# Altium project LimeSDR-Micro_mPCIe_1v4.PrjPcb (part 9 of 10)
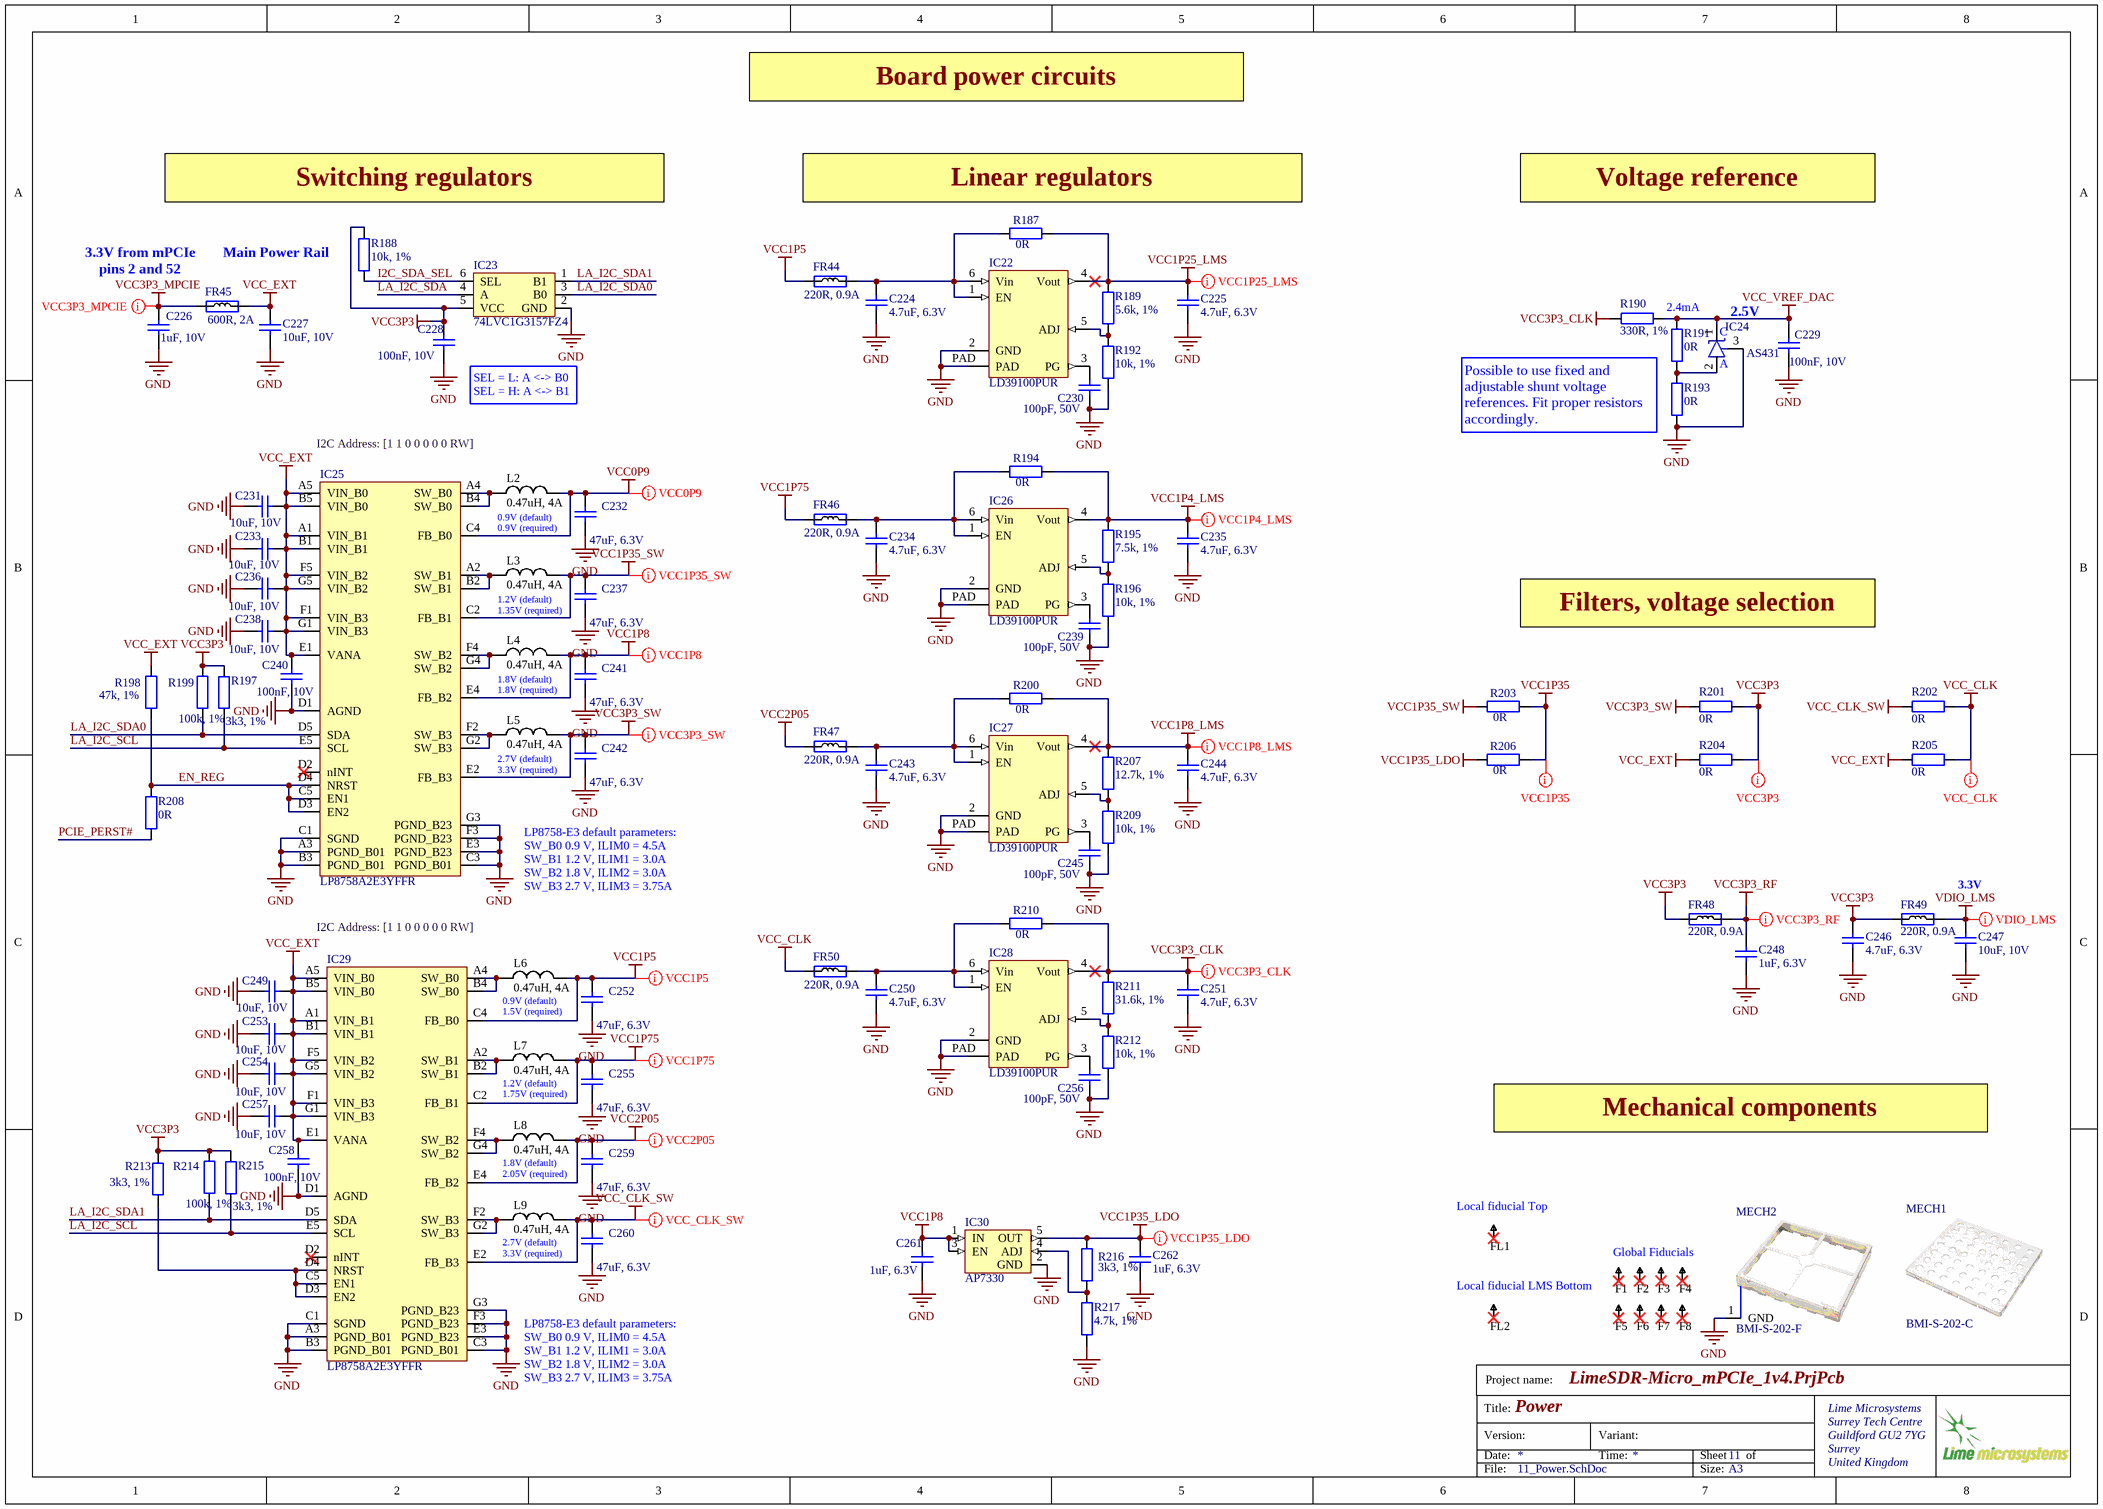
[diagram p14: 11_Power.SchDoc]

## Sheet 11_Power.SchDoc: Power (continued)
### Library data of the parts
C224 C225 C234 C235 C243 C244 C246 C250 C251 = Cap_0402: Manufacturer: Murata Electronics North America; Manufacturer Part Number 1: GRM155R60J475ME87D; Part Description: 4.7µF ±20% 6.3V X5R Ceramic Capacitor -55°C ~ 85°C Surface Mount, MLCC 0402 (1005 Metric) 0.039" L x 0.020" W (1.00mm x 0.50mm); Tolerance: ±20%; Capacitance: 4.7µF; Temperature Coefficient: X5R; Lead Style: -; Ratings: -; Height - Seated (Max): -; Thickness (Max): 0.022" (0.55mm); Voltage - Rated: 6.3V; Packaging: Cut Tape (CT); Lead Spacing: -; Category: Capacitors; Supplier Part Number 1: 490-5408-1-ND; Applications: General Purpose; Operating Temperature: -55°C ~ 85°C; Mounting Type: Surface Mount, MLCC; Features: Derating Recommended; RoHS: RoHS Compliant; Supplier 1: Digi-Key; Package / Case: 0402 (1005 Metric); Size / Dimension: 0.039" L x 0.020" W (1.00mm x 0.50mm); Value: 4.7uF, 6.3V
C226 = Cap_0402: Manufacturer Part Number 1: C1005X5R1E105K050BC; Manufacturer: TDK; Part Description: 1µF ±10% 10V X5R Ceramic Capacitor -55°C ~ 85°C Surface Mount, MLCC 0402 (1005 Metric) 0.039" L x 0.020" W (1.00mm x 0.50mm); Voltage Rating: 10; Capacitance Tolerance: ± 10%; Product Range: TDK - C Series; Ceramic Capacitor Case: 0402 [1005 Metric]; Capacitance: 1; Dielectric Characteristic: X6; Value: 1uF, 10V; Supplier 1: Digi-Key; Supplier Part Number 1: 445-9066-1-ND; MSL: -; RoHS: YES
C227 C233 C236 C238 C247 C249 C253 C254 C257 = Cap_0603: Part Description: 10 µF ±20% 10V Ceramic Capacitor X5R 0603 (1608 Metric); Manufacturer: Murata; Manufacturer Part Number 1: GRM188R61A106ME69D; Dielectric: X5R; Material: Ceramic; Tolerance: 20%; Value: 10uF, 10V; ComponentLink1Description: http://search.murata.co.jp/Ceramy/image/img/A01X/G101/ENG/GRM188R61C106MAAL-01.pdf?src-supplier=Digi-Key; ComponentLink1URL: http://search.murata.co.jp/Ceramy/image/img/A01X/G101/ENG/GRM188R61C106MAAL-01.pdf?src-supplier=Digi-Key; ComponentLink2Description: https://search.murata.co.jp/Ceramy/image/img/A01X/G101/ENG/GRM188R61C106MAAL-01.pdf?src-supplier=Digi-Key; ComponentLink2URL: https://search.murata.co.jp/Ceramy/image/img/A01X/G101/ENG/GRM188R61C106MAAL-01.pdf?src-supplier=Digi-Key; ComponentLink3Description: http://search.murata.co.jp/Ceramy/image/img/A01X/partnumbering_e_01.pdf?src-supplier=Digi-Key; ComponentLink3URL: http://search.murata.co.jp/Ceramy/image/img/A01X/partnumbering_e_01.pdf?src-supplier=Digi-Key; Capacitance: 10uF; Case/Package: 0603; Case Code (Imperial): 0603; Case Code (Metric): 1608; ComponentLink4Description: http://www.farnell.com/datasheets/1872210.pdf?src-supplier=Farnell; ComponentLink4URL: http://www.farnell.com/datasheets/1872210.pdf?src-supplier=Farnell; ComponentLink5Description: http://www.mouser.com/ds/2/281/c02e-2905.pdf?src-supplier=Mouser; ComponentLink5URL: http://www.mouser.com/ds/2/281/c02e-2905.pdf?src-supplier=Mouser; ComponentLink6Description: http://www.farnell.com/datasheets/1872210.pdf?src-supplier=Newark; ComponentLink6URL: http://www.farnell.com/datasheets/1872210.pdf?src-supplier=Newark; ComponentLink7Description: http://www.farnell.com/datasheets/2048014.pdf?src-supplier=Element14; ComponentLink7URL: http://www.farnell.com/datasheets/2048014.pdf?src-supplier=Element14; ComponentLink8Description: http://www.farnell.com/datasheets/1872210.pdf?src-supplier=Element14; ComponentLink8URL: http://www.farnell.com/datasheets/1872210.pdf?src-supplier=Element14; ComponentLink9Description: http://search.murata.co.jp/Ceramy/image/img/A01X/G101/ENG/GRM188R61A106ME69-01.pdf?src-supplier=Digi-Key; ComponentLink9URL: http://search.murata.co.jp/Ceramy/image/img/A01X/G101/ENG/GRM188R61A106ME69-01.pdf?src-supplier=Digi-Key; Depth: 0.8mm; Height: 0.8mm; Lead Free: Lead Free; Length: 1.6mm; Max Operating Temperature: 85°C; Min Operating Temperature: -55°C; Mount: Surface Mount; Package Quantity: 4000; Packaging: Tape and Reel; Pricing 1: 1=0,16000, 10=0,11200, 50=0,06360, 100=0,05270, 500=0,03696, 1000=0,03060 (USD); RoHS: Yes; RoHS Compliant: Yes; Series: GRM; Stock 1: 820978; Supplier 1: Digi-Key; Supplier Part Number 1: 490-10475-1-ND; Termination: SMD/SMT; Thickness: 0.035inch; Voltage Rating (DC): 10V; Voltage Rating: 10V; Weight: 0.000222oz; Width: 0.8mm
C228 C229 C240 C258 = Cap_0402: Part Description: 0.1 µF ±20% 10V Ceramic Capacitor X5R 0201 (0603 Metric); Manufacturer: Samsung; Manufacturer Part Number 1: CL03A104MP3NNNC; Tolerance: 20%; Value: 100nF, 10V; Capacitance: 100nF; Case/Package: 0201; Case Code (Imperial): 0201; Case Code (Metric): 0603; ComponentLink5Description: https://datasheet.ciiva.com/25788/cl03a104mp3nnnc-25788272.pdf?src-supplier=Digi-Key; ComponentLink5URL: https://datasheet.ciiva.com/25788/cl03a104mp3nnnc-25788272.pdf?src-supplier=Digi-Key; Length: 0.024inch; Max Operating Temperature: 85°C; Min Operating Temperature: -55°C; Mount: Surface Mount; Package Quantity: 1; Packaging: Tape and Reel; Pricing 1: 1=0,10000, 10=0,03000, 50=0,01640, 100=0,01330, 500=0,00950, 1000=0,00747, 2500=0,00679, 5000=0,00625 (USD); RoHS: Yes; RoHS Compliant: Yes; Series: CL; Stock 1: 3817176; Supplier 1: Digi-Key; Supplier Part Number 1: 1276-1321-1-ND; Thickness: 0.013inch; Voltage Rating (DC): 10V; Voltage Rating: 10V; Width: 0.012inch
C230 C239 C245 C256 = Cap_0402: Part Description: 100 pF ±5% 50V Ceramic Capacitor C0G, NP0 0201 (0603 Metric); Manufacturer: TDK; Manufacturer Part Number 1: C0603C0G1H101J030BA; Dielectric: C0G; Dielectric Material: Ceramic; Insulation Resistance: 10GR; Tolerance: 5%; Value: 100pF, 50V; Capacitance: 100pF; Case/Package: 0201; Case Code (Imperial): 0201; Case Code (Metric): 0603; ComponentLink1Description: https://datasheet.ciiva.com/24217/c0603c0g1h101j030ba-264106-24217425.pdf?src-supplier=Mouser; ComponentLink1URL: https://datasheet.ciiva.com/24217/c0603c0g1h101j030ba-264106-24217425.pdf?src-supplier=Mouser; ComponentLink2Description: https://datasheet.ciiva.com/16205/mlcc-commercial-general-en-16205590.pdf?src-supplier=Future+Electronics; ComponentLink2URL: https://datasheet.ciiva.com/16205/mlcc-commercial-general-en-16205590.pdf?src-supplier=Future+Electronics; ComponentLink3Description: https://datasheet.ciiva.com/6250/tdkmlcccaprange-6250351.pdf?src-supplier=Digi-Key; ComponentLink3URL: https://datasheet.ciiva.com/6250/tdkmlcccaprange-6250351.pdf?src-supplier=Digi-Key; Construction: Flat; Depth: 0.3mm; Height: 0.3mm; Lead Free: Lead Free; Length: 0.6mm; Max Operating Temperature: 125°C; Min Operating Temperature: -55°C; Mount: Surface Mount; Number of Pins: 2; Package Quantity: 1; Packaging: Tape and Reel; Pricing 1: 1=0,10000, 10=0,06000, 50=0,03280, 100=0,02670, 500=0,01908, 1000=0,01500, 2500=0,01364, 5000=0,01254 (USD); Reach SVHC Compliant: Yes; RoHS: Yes; RoHS Compliant: Yes; Series: C; Stock 1: 367528; Supplier 1: Digi-Key; Supplier Part Number 1: 445-1786-1-ND; Termination: SMD/SMT; Thickness: 0.013inch; Voltage: 50V; Voltage Rating (DC): 50V; Voltage Rating: 50V; Weight: 6E-06oz; Width: 0.012inch
C231 = Cap_0603: Part Description: 10 µF ±20% 10V Ceramic Capacitor X5R 0603 (1608 Metric); Manufacturer: Murata; Manufacturer Part Number 1: GRM188R61A106ME69D; Material: Ceramic; Tolerance: 20%; Dielectric: X5R; Value: 10uF, 10V; ComponentLink1URL: http://search.murata.co.jp/Ceramy/image/img/A01X/G101/ENG/GRM188R61C106MAAL-01.pdf?src-supplier=Digi-Key; ComponentLink1Description: http://search.murata.co.jp/Ceramy/image/img/A01X/G101/ENG/GRM188R61C106MAAL-01.pdf?src-supplier=Digi-Key; ComponentLink2URL: https://search.murata.co.jp/Ceramy/image/img/A01X/G101/ENG/GRM188R61C106MAAL-01.pdf?src-supplier=Digi-Key; ComponentLink2Description: https://search.murata.co.jp/Ceramy/image/img/A01X/G101/ENG/GRM188R61C106MAAL-01.pdf?src-supplier=Digi-Key; ComponentLink3URL: http://search.murata.co.jp/Ceramy/image/img/A01X/partnumbering_e_01.pdf?src-supplier=Digi-Key; ComponentLink3Description: http://search.murata.co.jp/Ceramy/image/img/A01X/partnumbering_e_01.pdf?src-supplier=Digi-Key; Supplier 1: Digi-Key; Supplier Part Number 1: 490-10475-1-ND; Stock 1: 820978; Pricing 1: 1=0,16000, 10=0,11200, 50=0,06360, 100=0,05270, 500=0,03696, 1000=0,03060 (USD); RoHS: Yes; Mount: Surface Mount; Case/Package: 0603; Case Code (Metric): 1608; Case Code (Imperial): 0603; Weight: 0.000222oz; Min Operating Temperature: -55°C; Max Operating Temperature: 85°C; Packaging: Tape and Reel; Capacitance: 10uF; Voltage Rating: 10V; Termination: SMD/SMT; Voltage Rating (DC): 10V; Package Quantity: 4000; Series: GRM; Length: 1.6mm; Width: 0.8mm; Height: 0.8mm; Thickness: 0.035inch; Depth: 0.8mm; Lead Free: Lead Free; RoHS Compliant: Yes; ComponentLink4URL: http://www.farnell.com/datasheets/1872210.pdf?src-supplier=Farnell; ComponentLink4Description: http://www.farnell.com/datasheets/1872210.pdf?src-supplier=Farnell; ComponentLink5URL: http://www.mouser.com/ds/2/281/c02e-2905.pdf?src-supplier=Mouser; ComponentLink5Description: http://www.mouser.com/ds/2/281/c02e-2905.pdf?src-supplier=Mouser; ComponentLink6URL: http://www.farnell.com/datasheets/1872210.pdf?src-supplier=Newark; ComponentLink6Description: http://www.farnell.com/datasheets/1872210.pdf?src-supplier=Newark; ComponentLink7URL: http://www.farnell.com/datasheets/2048014.pdf?src-supplier=Element14; ComponentLink7Description: http://www.farnell.com/datasheets/2048014.pdf?src-supplier=Element14; ComponentLink8URL: http://www.farnell.com/datasheets/1872210.pdf?src-supplier=Element14; ComponentLink8Description: http://www.farnell.com/datasheets/1872210.pdf?src-supplier=Element14; ComponentLink9URL: http://search.murata.co.jp/Ceramy/image/img/A01X/G101/ENG/GRM188R61A106ME69-01.pdf?src-supplier=Digi-Key; ComponentLink9Description: http://search.murata.co.jp/Ceramy/image/img/A01X/G101/ENG/GRM188R61A106ME69-01.pdf?src-supplier=Digi-Key
C232 C237 C241 C242 C252 C255 C259 C260 = Cap_0603: Part Description: 47 µF ±20% 6.3V Ceramic Capacitor X5R 0603 (1608 Metric); Manufacturer: Murata; Manufacturer Part Number 1: GRM188R60J476ME15D; Tolerance: 20%; Dielectric: X5R; Value: 47uF, 6.3V; Supplier 1: Digi-Key; Supplier Part Number 1: 490-13247-1-ND; Stock 1: 731453; Pricing 1: 1=0,45000, 10=0,31900, 50=0,24120, 100=0,21000, 500=0,15556, 1000=0,13223 (USD); RoHS: Yes; Mount: Surface Mount; Case/Package: 0603; Case Code (Metric): 1608; Case Code (Imperial): 0603; Min Operating Temperature: -55°C; Max Operating Temperature: 85°C; Packaging: Tape and Reel; Capacitance: 47uF; Voltage Rating: 6.3V; Voltage Rating (DC): 6.3V; Length: 0.063inch; Width: 0.031inch; Thickness: 0.039inch; RoHS Compliant: Yes; ComponentLink1URL: http://search.murata.co.jp/Ceramy/image/img/A01X/G101/ENG/GRM188R60J476ME15-01.pdf?src-supplier=Digi-Key; ComponentLink1Description: http://search.murata.co.jp/Ceramy/image/img/A01X/G101/ENG/GRM188R60J476ME15-01.pdf?src-supplier=Digi-Key; ComponentLink2URL: https://www.murata.com/~/media/webrenewal/support/library/catalog/products/capacitor/mlcc/c02e.ashx?la=en-us&src-supplier=Digi-Key; ComponentLink2Description: https://www.murata.com/~/media/webrenewal/support/library/catalog/products/capacitor/mlcc/c02e.ashx?la=en-us&src-supplier=Digi-Key
C248 C261 C262 = Cap_0402: Manufacturer: TDK Corporation; Manufacturer Part Number 1: JMK063ABJ105MP-F; Part Description: 1µF ±20% 6.3V X5R Ceramic Capacitor -55°C ~ 85°C Surface Mount, MLCC 0201 (0603 Metric) 0.024" L x 0.012" W (0.60mm x 0.30mm); Value: 1uF, 20%; Tolerance: ±20%; Capacitance: 1.0µF; Temperature Coefficient: X5R; Supplier 1: Digi-Key; Supplier Part Number 1: 587-5864-2-ND; Applications: General Purpose; Features: -; Lead Style: -; Ratings: -; Thickness (Max): -; Lead Spacing: -; Height - Seated (Max): -; Size / Dimension: 0.024" L x 0.012" W (0.60mm x 0.30mm); Mounting Type: Surface Mount, MLCC; Operating Temperature: -55°C ~ 85°C; Package / Case: 0201 (0603 Metric); Packaging: Cut Tape (CT); Voltage - Rated: 6.3V; Category: Capacitors; RoHS: RoHS Compliant
FR44 FR46-FR50 = Ferrite: Manufacturer: TDK Corporation; Manufacturer Part Number 1: MPZ1005S221ET000; Part Description: FERRITE BEAD 220 OHM 0402 1LN; Impedance @ Frequency: 220 Ohm @ 100MHz; Current Rating: 900mA; DC Resistance (DCR): 220 mOhm Max; Supplier 1: Digi-Key; Package / Case: 0402 (1005 Metric); Category: Filters; Supplier Part Number 1: 445-9329-2-ND; Value: 220R, 0.9A
FR45 = Ferrite: Manufacturer Part Number 1: MPZ2012S601AT000; Manufacturer: TDK Corporation; Part Description: FERRITE BEAD 600 OHM 0805 1LN; Filter Type: Differential Mode - Single; Impedance @ Frequency: 600 Ohm @ 100MHz; DC Resistance (DCR): 100 mOhm Max; Supplier 1: Digi-Key; Supplier Part Number 1: 445-2206-2-ND; Mounting Type: Surface Mount; RoHS: RoHS Compliant; Height (Max): 0.041" (1.05mm); Packaging: Tape & Reel (TR); Category: Filters; Current Rating: 2A; Package / Case: 0805 (2012 Metric); Size / Dimension: 0.079" L x 0.049" W (2.00mm x 1.25mm)
IC22 IC26-IC28 = LD39100PUR: Manufacturer: STMicroelectronics; Part Description: Linear Voltage Regulator IC Positive Adjustable Output 0.8 V ~ 4.5 V 1A 6-DFN (3x3); Output Configuration: Positive; Output Type: Adjustable; Voltage - Input (Max): 5.5V; Voltage - Output (Min/Fixed): 0.8V; Voltage - Output (Max): 4.6V; Voltage Dropout (Max): 0.4V @ 1A; Current - Output: 1A; Current - Supply: 50µA ~ 300µA; PSRR: 70dB ~ 65dB (1kHz ~ 10kHz); Control Features: Enable, Power Good; Protection Features: Over Current, Over Temperature, Short Circuit; Supplier 1: Digi-Key; Manufacturer Part Number 1: LD39100PUR; RoHS: RoHS Compliant; Category: Integrated Circuits (ICs); Stock 1: 27970; Pricing 1: 1=0.85, 10=0.76, 100=0.5923, 500=0.48926, 1000=0.38625 (USD); Packaging: Cut Tape (CT); Part Status: Active; Operating Temperature: -40°C ~ 125°C; Mounting Type: Surface Mount; Package / Case: 6-VDFN Exposed Pad; Supplier Device Package: 6-DFN (3x3); ComponentLink1URL: http://www.st.com/content/ccc/resource/technical/document/datasheet/72/02/e5/ee/df/36/40/5e/CD00233788.pdf/files/CD00233788.pdf/jcr:content/translations/en.CD00233788.pdf; ComponentLink1Description: http://www.st.com/content/ccc/resource/technical/document/datasheet/72/02/e5/ee/df/36/40/5e/CD00233788.pdf/files/CD00233788.pdf/jcr:content/translations/en.CD00233788.pdf; Supplier Part Number 1: 497-11013-1-ND
IC23 = 74LVC1G3157FZ4_SPDT_SW: Part Description: 1 Circuit IC Switch 2:1 10Ohm X2-DFN1410-6; Manufacturer: Diodes; Manufacturer Part Number 1: 74LVC1G3157FZ4-7; Number of Circuits: 1; On-State Resistance: 10R; -3db Bandwidth: 300MHz; Supplier 1: Digi-Key; Supplier Part Number 1: 74LVC1G3157FZ4-7DICT-ND; Stock 1: 158709; Pricing 1: 1=0,42000, 10=0,31200, 25=0,27320, 100=0,17670, 250=0,14628, 500=0,11702, 1000=0,08972, 2500=0,07802 (USD); RoHS: Yes; Number of Pins: 6; Min Operating Temperature: -40°C; Max Operating Temperature: 125°C; Packaging: Tape and Reel; RoHS Compliant: Yes; ComponentLink1URL: https://www.diodes.com/assets/Datasheets/74LVC1G3157.pdf?src-supplier=Digi-Key; ComponentLink1Description: https://www.diodes.com/assets/Datasheets/74LVC1G3157.pdf?src-supplier=Digi-Key; ComponentLink2URL: https://www.diodes.com/assets/product-showcases/74LVC3157-NPA-0516.pdf?src-supplier=Digi-Key; ComponentLink2Description: https://www.diodes.com/assets/product-showcases/74LVC3157-NPA-0516.pdf?src-supplier=Digi-Key
IC24 = VOLTAGE_REFERENCE_UNIVERSAL: Part Description: Shunt Voltage Reference IC Adjustable 2.5V 36 VV ±0.5% 100 mA SOT-23-3; Manufacturer: Diodes; Manufacturer Part Number 1: AS431ANTR-G1; ComponentLink1URL: https://datasheet.ciiva.com/1177/1643148-1177233.pdf?src-supplier=Avnet; ComponentLink1Description: https://datasheet.ciiva.com/1177/1643148-1177233.pdf?src-supplier=Avnet; ComponentLink2Description: https://datasheet.ciiva.com/30002/as431-30002029.pdf?src-supplier=Avnet; ComponentLink2URL: https://datasheet.ciiva.com/30002/as431-30002029.pdf?src-supplier=Avnet; ComponentLink3Description: https://datasheet.ciiva.com/29572/as431-29572149.pdf?src-supplier=Digi-Key; ComponentLink3URL: https://datasheet.ciiva.com/29572/as431-29572149.pdf?src-supplier=Digi-Key; ComponentLink4Description: https://datasheet.ciiva.com/29572/as431-29572150.pdf?src-supplier=Digi-Key; ComponentLink4URL: https://datasheet.ciiva.com/29572/as431-29572150.pdf?src-supplier=Digi-Key; ComponentLink5URL: https://datasheet.ciiva.com/8132/lm4040-8132551.pdf?src-supplier=Avnet; ComponentLink5Description: https://datasheet.ciiva.com/8132/lm4040-8132551.pdf?src-supplier=Avnet; Value: AS431; Supplier 1: Digikey; Supplier Part Number 1: AS431ANTR-G1DICT-ND; Stock 1: 655820; Pricing 1: 1=0,32, 10=0,196, 25=0,162, 100=0,1226, 250=0,10304, 500=0,09098, 1000=0,08085 (USD); RoHS: Yes; ComponentLink6URL: https://datasheet.ciiva.com/29572/as431-29572149.pdf?src-supplier=Digikey; ComponentLink6Description: https://datasheet.ciiva.com/29572/as431-29572149.pdf?src-supplier=Digikey; ComponentLink7URL: https://datasheet.ciiva.com/29572/as431-29572150.pdf?src-supplier=Digikey; ComponentLink7Description: https://datasheet.ciiva.com/29572/as431-29572150.pdf?src-supplier=Digikey
IC25 = LP8758A1E0YFFR_QUAD_DC-DC: Part Description: Buck Switching Regulator IC Positive Programmable 0.5V 4 Output 4A 35-UFBGA, DSBGA; Manufacturer: Texas Instruments; ComponentLink1URL: http://www.ti.com/general/docs/suppproductinfo.tsp?distId=10&amp;gotoUrl=http%3A%2F%2Fwww.ti.com%2Flit%2Fgpn%2Flp8758-e0&src-supplier=Digi-Key; ComponentLink1Description: http://www.ti.com/general/docs/suppproductinfo.tsp?distId=10&amp;gotoUrl=http%3A%2F%2Fwww.ti.com%2Flit%2Fgpn%2Flp8758-e0&src-supplier=Digi-Key; ComponentLink2URL: http://www.ti.com/lit/gpn/lp8758-e0?src-supplier=Mouser; ComponentLink2Description: http://www.ti.com/lit/gpn/lp8758-e0?src-supplier=Mouser; ComponentLink3URL: http://www.ti.com/lit/ds/symlink/lp8758-e0.pdf?src-supplier=Digi-Key; ComponentLink3Description: http://www.ti.com/lit/ds/symlink/lp8758-e0.pdf?src-supplier=Digi-Key; Supplier 1: Digi-Key; Supplier Part Number 1: 296-LP8758A2E3YFFRCT-ND; Manufacturer Part Number 1: LP8758A2E3YFFR; Stock 1: 5990; Pricing 1: 1=5,83, 10=5,235, 25=4,9496, 100=4,2896, 250=4,0696, 500=3,65164, 1000=3,07969 (USD); RoHS: Yes
IC29 = LP8758A1E0YFFR_QUAD_DC-DC: Part Description: Switching Voltage Regulators Four-phase, four 4A output DC-DC step-down converters 35-DSBGA -40 to 85; Manufacturer: Texas Instruments; ComponentLink1URL: http://www.ti.com/general/docs/suppproductinfo.tsp?distId=10&amp;gotoUrl=http%3A%2F%2Fwww.ti.com%2Flit%2Fgpn%2Flp8758-e0&src-supplier=Digi-Key; ComponentLink1Description: http://www.ti.com/general/docs/suppproductinfo.tsp?distId=10&amp;gotoUrl=http%3A%2F%2Fwww.ti.com%2Flit%2Fgpn%2Flp8758-e0&src-supplier=Digi-Key; ComponentLink2URL: http://www.ti.com/lit/gpn/lp8758-e0?src-supplier=Mouser; ComponentLink2Description: http://www.ti.com/lit/gpn/lp8758-e0?src-supplier=Mouser; ComponentLink3URL: http://www.ti.com/lit/ds/symlink/lp8758-e0.pdf?src-supplier=Digi-Key; ComponentLink3Description: http://www.ti.com/lit/ds/symlink/lp8758-e0.pdf?src-supplier=Digi-Key; Supplier 1: Digi-Key; Supplier Part Number 1: 296-LP8758A2E3YFFRCT-ND; Manufacturer Part Number 1: LP8758A2E3YFFR; Stock 1: 5990; Pricing 1: 1=5,83, 10=5,235, 25=4,9496, 100=4,2896, 250=4,0696, 500=3,65164, 1000=3,07969 (USD); RoHS: Yes
IC30 = AP7330-W5-7_LDO: Part Description: Linear Voltage Regulator IC Positive Adjustable 1 Output 300mA SOT-25; Manufacturer: Diodes; Supplier 1: Digi-Key; Supplier Part Number 1: AP7330-W5-7DICT-ND; Manufacturer Part Number 1: AP7330-W5-7; Stock 1: 50531; Pricing 1: 1=0,35, 10=0,286, 25=0,2616, 100=0,1946, 250=0,17632, 500=0,14592, 1000=0,10944 (USD); RoHS: Yes; ComponentLink1URL: https://datasheet.octopart.com/AP7330-W5-7-Diodes-Inc.-datasheet-149521347.pdf?src-supplier=Farnell; ComponentLink1Description: https://datasheet.octopart.com/AP7330-W5-7-Diodes-Inc.-datasheet-149521347.pdf?src-supplier=Farnell; ComponentLink2URL: https://www.diodes.com/assets/Datasheets/AP7330.pdf?src-supplier=Digi-Key; ComponentLink2Description: https://www.diodes.com/assets/Datasheets/AP7330.pdf?src-supplier=Digi-Key
L2-L9 = Inductor: Part Description: 470 nH Shielded Drum Core, Wirewound Inductor 2.81 A 41mOhm Max 0806 (2016 Metric); Manufacturer: TDK; Manufacturer Part Number 1: VLS201610HBX-R47M-1; Core Material: Metal; Inductance Tolerance: 20%; Inductance: 470nH; Current Rating: 2.81A; Saturation Current: 3.5A; Shielding: Shielded; DC Resistance (DCR): 41mR; Test Frequency: 1MHz; RMS Current (Irms): 3.3A; Value: 0.47uH, 4A; Supplier 1: Digi-Key; Supplier Part Number 1: 445-172395-1-ND; Stock 1: 1817; Pricing 1: 1=0,35000, 10=0,31200, 25=0,27320, 50=0,23400, 100=0,21450, 250=0,19504, 500=0,18334, 1000=0,14043 (USD); RoHS: Yes; Mount: Surface Mount; Case/Package: 0806; Case Code (Metric): 2016; Case Code (Imperial): 0806; Min Operating Temperature: -40°C; Max Operating Temperature: 105°C; Packaging: Cut Tape; Resistor Type: Wirewound; Tolerance: 20%; Length: 0.079inch; Width: 0.063inch; Height - Seated (Max): 0.039inch; Reach SVHC Compliant: No SVHC; RoHS Compliant: Yes; ComponentLink1URL: http://www.farnell.com/datasheets/2130008.pdf?src-supplier=Farnell; ComponentLink1Description: http://www.farnell.com/datasheets/2130008.pdf?src-supplier=Farnell; ComponentLink2URL: http://www.farnell.com/datasheets/1866267.pdf?src-supplier=Element14; ComponentLink2Description: http://www.farnell.com/datasheets/1866267.pdf?src-supplier=Element14; ComponentLink3URL: http://www.farnell.com/datasheets/2130008.pdf?src-supplier=Element14; ComponentLink3Description: http://www.farnell.com/datasheets/2130008.pdf?src-supplier=Element14; ComponentLink4URL: https://product.tdk.com/info/en/catalog/datasheets/inductor_commercial_power_vls201610hbx-1_en.pdf?src-supplier=Digi-Key; ComponentLink4Description: https://product.tdk.com/info/en/catalog/datasheets/inductor_commercial_power_vls201610hbx-1_en.pdf?src-supplier=Digi-Key; ComponentLink5URL: https://product.tdk.com/info/en/catalog/datasheets/inductor_commercial_power_vls201610hbx-1_en.pdf?ref_disty=digikey&src-supplier=Digi-Key; ComponentLink5Description: https://product.tdk.com/info/en/catalog/datasheets/inductor_commercial_power_vls201610hbx-1_en.pdf?ref_disty=digikey&src-supplier=Digi-Key
MECH1 = RFI_SHIELD_COVER_BMI-S-202-C: Part Description: RF Shield Cover 0.668" (16.96mm) X 0.668" (16.96mm) Vent Holes in Pattern Snap Fit; Manufacturer: Laird; ComponentLink1URL: https://www.leadertechinc.com/assets/files/EngineeringDrawings/SMS-206.PDF; ComponentLink1Description: https://www.leadertechinc.com/assets/files/EngineeringDrawings/SMS-206.PDF; Supplier 1: Digi-Key; Supplier Part Number 1: 903-1014-ND; Manufacturer Part Number 1: BMI-S-202-C; Stock 1: 245970; Pricing 1: 1=1,68000, 10=1,51300, 25=1,42760, 100=1,21620, 250=1,14200, 500=0,99924, 1000=0,82795, 2500=0,77085, 5000=0,74230 (USD); RoHS: Yes; Color: Grey; Material: Aluminium; Package Quantity: 1400; Packaging: Bulk; Series: SMT 2 Piece; Length: 16.5mm; Width: 16.5mm; Depth: 3.6mm; ComponentLink2URL: http://www.farnell.com/datasheets/1965028.pdf?src-supplier=Farnell; ComponentLink2Description: http://www.farnell.com/datasheets/1965028.pdf?src-supplier=Farnell; ComponentLink3URL: http://www.mouser.com/ds/2/223/Laird_BMIS_201_210-201562.pdf?src-supplier=Mouser; ComponentLink3Description: http://www.mouser.com/ds/2/223/Laird_BMIS_201_210-201562.pdf?src-supplier=Mouser; ComponentLink4URL: http://www.farnell.com/datasheets/1965028.pdf?src-supplier=Newark; ComponentLink4Description: http://www.farnell.com/datasheets/1965028.pdf?src-supplier=Newark; ComponentLink5URL: http://www.farnell.com/datasheets/1965028.pdf?src-supplier=Element14; ComponentLink5Description: http://www.farnell.com/datasheets/1965028.pdf?src-supplier=Element14; ComponentLink6URL: http://assets.lairdtech.com/home/brandworld/files/Board%20Level%20Shields%20Catalog%20Download.pdf?src-supplier=Digi-Key; ComponentLink6Description: http://assets.lairdtech.com/home/brandworld/files/Board%20Level%20Shields%20Catalog%20Download.pdf?src-supplier=Digi-Key; ComponentLink7URL: http://assets.lairdtech.com/home/brandworld/files/Board%20Level%20Shields%20Catalog%20Download.pdf?src-supplier=Quest; ComponentLink7Description: http://assets.lairdtech.com/home/brandworld/files/Board%20Level%20Shields%20Catalog%20Download.pdf?src-supplier=Quest
MECH2 = RFI_SHIELD_FRAME_BMI-S-202-F: Part Description: RF Shield Frame 0.650" (16.50mm) X 0.650" (16.50mm) Surface Mount; Manufacturer: Laird; ComponentLink1URL: https://www.leadertechinc.com/assets/files/EngineeringDrawings/SMS-206.PDF; ComponentLink1Description: https://www.leadertechinc.com/assets/files/EngineeringDrawings/SMS-206.PDF; Supplier 1: Digi-Key; Supplier Part Number 1: 903-1051-1-ND; Manufacturer Part Number 1: BMI-S-202-F; Stock 1: 239502; Pricing 1: 1=1,94000, 10=1,74100, 25=1,64280, 100=1,39970, 250=1,31428 (USD); RoHS: Yes; Mount: Solder; Material: Aluminium; Color: Grey; Package Quantity: 700; Packaging: Tape and Reel; Length: 16.5mm; Width: 16.5mm; Depth: 3.6mm; Reach SVHC Compliant: Unknown; ComponentLink2URL: https://datasheet.ciiva.com/2799/bmi-s-202-2799404.pdf?src-supplier=Digi-Key; ComponentLink2Description: https://datasheet.ciiva.com/2799/bmi-s-202-2799404.pdf?src-supplier=Digi-Key
R187 R191 R193 R194 R200 R203 R206 R208 R210 = Res_0402: Part Description: 0 Ohms Jumper Chip Resistor 0201 (0603 Metric) Moisture Resistant Thick Film; Manufacturer: Yageo; Manufacturer Part Number 1: RC0201JR-070RL; Power Rating: 50mW; Tolerance: 5%; Voltage Rating: 25V; ComponentLink1URL: http://www.yageo.com/documents/recent/PYu-RC_Group_51_RoHS_L_7.pdf; ComponentLink1Description: http://www.yageo.com/documents/recent/PYu-RC_Group_51_RoHS_L_7.pdf; Value: 0R; Supplier 1: Digi-Key; Supplier Part Number 1: 311-0.0NCT-ND; Stock 1: 6252381; Pricing 1: 1=0,10000, 10=0,03700, 25=0,02680, 50=0,02020, 100=0,01500, 250=0,01140, 500=0,00912, 1000=0,00672, 5000=0,00482 (USD); RoHS: Yes; Case/Package: 0201; Case Code (Metric): 0603; Case Code (Imperial): 0201; Weight: 6E-06oz; Contact Plating: Tin,Matte; Size Code: 0201; Min Operating Temperature: -55°C; Max Operating Temperature: 125°C; Packaging: Tape and Reel; Resistance: 0R; Package Quantity: 1; Resistor Type: Thick Film; Number of Terminations: 2; Termination: SMD/SMT; Max Power Dissipation: 50mW; Voltage Rating (DC): 25V; Features: Moisture Resistant; Series: RC; Construction: Rectangular; Resistance Tolerance: 5%; Length: 0.024inch; Width: 0.012inch; Height: 0.01inch; Depth: 0.3mm; Radiation Hardening: No; Military Standard: Not; Lead Free: Lead Free; RoHS Compliant: Yes; ComponentLink2URL: https://datasheet.ciiva.com/7672/1563626-7672248.pdf?src-supplier=Element14; ComponentLink2Description: https://datasheet.ciiva.com/7672/1563626-7672248.pdf?src-supplier=Element14; ComponentLink3URL: https://datasheet.ciiva.com/7672/1563626-7672247.pdf?src-supplier=Element14; ComponentLink3Description: https://datasheet.ciiva.com/7672/1563626-7672247.pdf?src-supplier=Element14; ComponentLink4URL: https://datasheet.ciiva.com/7660/1421516-7660808.pdf?src-supplier=Element14; ComponentLink4Description: https://datasheet.ciiva.com/7660/1421516-7660808.pdf?src-supplier=Element14; ComponentLink5URL: https://datasheet.ciiva.com/46391/1421516-46391340.pdf?src-supplier=Element14; ComponentLink5Description: https://datasheet.ciiva.com/46391/1421516-46391340.pdf?src-supplier=Element14
R188 R192 R196 R209 R212 = Res_0402: Manufacturer: Yageo; Manufacturer Part Number 1: RC0201FR-0710KL; Part Description: 10 kOhms ±1% 0.05W, 1/20W Chip Resistor 0201 (0603 Metric) Moisture Resistant Thick Film; Resistance: 10kR; Power Rating: 50mW; Voltage Rating: 25V; Temperature Coefficient: 200ppm/°C; Value: 10k, 1%; ComponentLink1URL: https://datasheet.ciiva.com/5924/1563626-5924912.pdf?src-supplier=Farnell; ComponentLink1Description: https://datasheet.ciiva.com/5924/1563626-5924912.pdf?src-supplier=Farnell; ComponentLink2URL: https://datasheet.ciiva.com/22661/1563626-22661319.pdf?src-supplier=Element14; ComponentLink2Description: https://datasheet.ciiva.com/22661/1563626-22661319.pdf?src-supplier=Element14; Supplier 1: Digi-Key; Supplier Part Number 1: 311-10.0KMCT-ND; Stock 1: 17142315; Pricing 1: 1=0,10000, 10=0,03700, 100=0,01530, 1000=0,00685, 2500=0,00595, 5000=0,00491 (USD); RoHS: Yes; Case/Package: 0201; Number of Pins: 2; Case Code (Imperial): 0201; Case Code (Metric): 0603; Contact Plating: Tin,Matte; Weight: 6E-06oz; Min Operating Temperature: -55°C; Max Operating Temperature: 125°C; Tolerance: 1%; Packaging: Tape and Reel; Package Quantity: 10000; Termination: SMD/SMT; Resistor Type: Thick Film; Number of Terminations: 2; Max Power Dissipation: 50mW; Voltage Rating (DC): 25V; Features: Moisture Resistant; Series: RC; Resistance Tolerance: 1%; Construction: Rectangular; Working Voltage: 25V; Technology: THICK FILM; Length: 0.6mm; Width: 0.012inch; Height: 0.01inch; Depth: 0.3mm; Radiation Hardening: No; Reach SVHC Compliant: Yes; Military Standard: Not; Lead Free: Lead Free; RoHS Compliant: Yes; ComponentLink3URL: https://datasheet.ciiva.com/7660/1421516-7660807.pdf?src-supplier=Element14; ComponentLink3Description: https://datasheet.ciiva.com/7660/1421516-7660807.pdf?src-supplier=Element14; ComponentLink4URL: https://datasheet.ciiva.com/46391/1421516-46391339.pdf?src-supplier=Element14; ComponentLink4Description: https://datasheet.ciiva.com/46391/1421516-46391339.pdf?src-supplier=Element14; ComponentLink5URL: https://datasheet.ciiva.com/2467/pyu-r-int-thick-7-2467110.pdf?src-supplier=Digi-Key; ComponentLink5Description: https://datasheet.ciiva.com/2467/pyu-r-int-thick-7-2467110.pdf?src-supplier=Digi-Key; ComponentLink6URL: https://datasheet.ciiva.com/2467/pyu-r-int-thick-7-2467111.pdf?src-supplier=Digi-Key; ComponentLink6Description: https://datasheet.ciiva.com/2467/pyu-r-int-thick-7-2467111.pdf?src-supplier=Digi-Key; ComponentLink7URL: https://datasheet.ciiva.com/2467/pyu-r-int-thick-7-2467109.pdf?src-supplier=Digi-Key; ComponentLink7Description: https://datasheet.ciiva.com/2467/pyu-r-int-thick-7-2467109.pdf?src-supplier=Digi-Key
R189 = Res_0402: Manufacturer: Yageo; Manufacturer Part Number 1: RC0201FR-075K6L; Part Description: 5.6 kOhms ±1% 0.05W, 1/20W Chip Resistor 0201 (0603 Metric) Moisture Resistant Thick Film; Resistance: 5.6kR; Power Rating: 50mW; Voltage Rating: 25V; Temperature Coefficient: 200ppm/°C; Value: 5.6k, 1%; ComponentLink1URL: https://datasheet.ciiva.com/5924/1563626-5924912.pdf?src-supplier=Farnell; ComponentLink1Description: https://datasheet.ciiva.com/5924/1563626-5924912.pdf?src-supplier=Farnell; ComponentLink2URL: https://datasheet.ciiva.com/22661/1563626-22661319.pdf?src-supplier=Element14; ComponentLink2Description: https://datasheet.ciiva.com/22661/1563626-22661319.pdf?src-supplier=Element14; ComponentLink3URL: https://datasheet.ciiva.com/7660/1421516-7660807.pdf?src-supplier=Element14; ComponentLink3Description: https://datasheet.ciiva.com/7660/1421516-7660807.pdf?src-supplier=Element14; ComponentLink4URL: https://datasheet.ciiva.com/46391/1421516-46391339.pdf?src-supplier=Element14; ComponentLink4Description: https://datasheet.ciiva.com/46391/1421516-46391339.pdf?src-supplier=Element14; ComponentLink5URL: https://datasheet.ciiva.com/2467/pyu-r-int-thick-7-2467110.pdf?src-supplier=Digi-Key; ComponentLink5Description: https://datasheet.ciiva.com/2467/pyu-r-int-thick-7-2467110.pdf?src-supplier=Digi-Key; ComponentLink6URL: https://datasheet.ciiva.com/2467/pyu-r-int-thick-7-2467111.pdf?src-supplier=Digi-Key; ComponentLink6Description: https://datasheet.ciiva.com/2467/pyu-r-int-thick-7-2467111.pdf?src-supplier=Digi-Key; ComponentLink7URL: https://datasheet.ciiva.com/2467/pyu-r-int-thick-7-2467109.pdf?src-supplier=Digi-Key; ComponentLink7Description: https://datasheet.ciiva.com/2467/pyu-r-int-thick-7-2467109.pdf?src-supplier=Digi-Key; Supplier 1: Digi-Key; Supplier Part Number 1: YAG2346CT-ND; Stock 1: 808399; Pricing 1: 1=0,10000, 10=0,03700, 100=0,01500, 1000=0,00672, 2500=0,00583, 5000=0,00482 (USD); RoHS: Yes; Case/Package: 0201; Case Code (Metric): 0603; Case Code (Imperial): 0201; Min Operating Temperature: -55°C; Max Operating Temperature: 125°C; Package Quantity: 10000; Packaging: Tape and Reel; Tolerance: 1%; Resistor Type: Thick Film; Number of Terminations: 2; Termination: SMD/SMT; Max Power Dissipation: 50mW; Features: Moisture Resistant; Series: RC; Resistance Tolerance: 1%; Length: 0.024inch; Width: 0.3mm; Height: 0.01inch; Reach SVHC Compliant: Yes; RoHS Compliant: Yes; ComponentLink8URL: https://datasheet.ciiva.com/22661/1563626-22661325.pdf?src-supplier=Element14; ComponentLink8Description: https://datasheet.ciiva.com/22661/1563626-22661325.pdf?src-supplier=Element14
R190 = Res_0402: Manufacturer: Vishay Dale; Manufacturer Part Number 1: CRCW0201330RFKED; Part Description: 330 Ohms ±1% 0.05W, 1/20W Chip Resistor 0201 (0603 Metric) Thick Film; Power Rating: 50mW; Voltage Rating: 30V; Temperature Coefficient: 100ppm/°C; ComponentLink1URL: https://datasheet.ciiva.com/8944/crcw0201e3-8944937.pdf?src-supplier=Avnet; ComponentLink1Description: https://datasheet.ciiva.com/8944/crcw0201e3-8944937.pdf?src-supplier=Avnet; Value: 330R, 1%; Supplier 1: Digi-Key; Supplier Part Number 1: 541-330AABCT-ND; Stock 1: 245078; Pricing 1: 1=0,27000, 10=0,23000, 100=0,08990, 1000=0,03762, 2500=0,03448, 5000=0,03135 (USD); RoHS: Yes; Case/Package: 0201; Case Code (Metric): 0603; Case Code (Imperial): 0201; Contact Plating: Tin; Size Code: 0201; Min Operating Temperature: -55°C; Max Operating Temperature: 155°C; Resistance: 330R; Tolerance: 1%; Packaging: Tape and Reel; Package Quantity: 1; Resistor Type: Thick Film; Number of Terminations: 2; Max Power Dissipation: 50mW; Series: CRCW; Length: 0.6mm; Width: 0.3mm; Height: 0.011inch; Radiation Hardening: No; Lead Free: Lead Free; RoHS Compliant: Yes; ComponentLink2URL: https://datasheet.ciiva.com/2473/crcw0201e3-2473436.pdf?src-supplier=Digi-Key; ComponentLink2Description: https://datasheet.ciiva.com/2473/crcw0201e3-2473436.pdf?src-supplier=Digi-Key; ComponentLink3URL: https://datasheet.ciiva.com/2473/crcw0201e3-2473437.pdf?src-supplier=Digi-Key; ComponentLink3Description: https://datasheet.ciiva.com/2473/crcw0201e3-2473437.pdf?src-supplier=Digi-Key; ComponentLink4URL: https://datasheet.ciiva.com/2473/crcw0201e3-2473438.pdf?src-supplier=Digi-Key; ComponentLink4Description: https://datasheet.ciiva.com/2473/crcw0201e3-2473438.pdf?src-supplier=Digi-Key; ComponentLink5URL: https://datasheet.ciiva.com/16394/dcrcwe3-16394575.pdf?src-supplier=Future+Electronics; ComponentLink5Description: https://datasheet.ciiva.com/16394/dcrcwe3-16394575.pdf?src-supplier=Future+Electronics; Construction: Rectangular; Depth: 0.3mm; Military Standard: Not; Weight: 6E-06oz
R195 = Res_0402: Manufacturer: Stackpole Electronics; Manufacturer Part Number 1: RMCF0201FT7K50; Part Description: 7.5 kOhms ±1% 0.05W, 1/20W Chip Resistor 0201 (0603 Metric) Thick Film; Resistance: 7.5kR; Max Power Dissipation: 50mW; Temperature Coefficient: 200ppm/°C; Value: 7.5k, 1%; ComponentLink1URL: https://datasheet.ciiva.com/5924/1563626-5924912.pdf?src-supplier=Farnell; ComponentLink1Description: https://datasheet.ciiva.com/5924/1563626-5924912.pdf?src-supplier=Farnell; ComponentLink2URL: https://datasheet.ciiva.com/22661/1563626-22661319.pdf?src-supplier=Element14; ComponentLink2Description: https://datasheet.ciiva.com/22661/1563626-22661319.pdf?src-supplier=Element14; ComponentLink3URL: https://datasheet.ciiva.com/7660/1421516-7660807.pdf?src-supplier=Element14; ComponentLink3Description: https://datasheet.ciiva.com/7660/1421516-7660807.pdf?src-supplier=Element14; ComponentLink4URL: https://datasheet.ciiva.com/46391/1421516-46391339.pdf?src-supplier=Element14; ComponentLink4Description: https://datasheet.ciiva.com/46391/1421516-46391339.pdf?src-supplier=Element14; ComponentLink5URL: https://datasheet.ciiva.com/2467/pyu-r-int-thick-7-2467110.pdf?src-supplier=Digi-Key; ComponentLink5Description: https://datasheet.ciiva.com/2467/pyu-r-int-thick-7-2467110.pdf?src-supplier=Digi-Key; ComponentLink6URL: https://datasheet.ciiva.com/2467/pyu-r-int-thick-7-2467111.pdf?src-supplier=Digi-Key; ComponentLink6Description: https://datasheet.ciiva.com/2467/pyu-r-int-thick-7-2467111.pdf?src-supplier=Digi-Key; ComponentLink7URL: https://datasheet.ciiva.com/2467/pyu-r-int-thick-7-2467109.pdf?src-supplier=Digi-Key; ComponentLink7Description: https://datasheet.ciiva.com/2467/pyu-r-int-thick-7-2467109.pdf?src-supplier=Digi-Key; Supplier 1: Digi-Key; Supplier Part Number 1: RMCF0201FT7K50CT-ND; Stock 1: 145930; Pricing 1: 1=0,10000, 10=0,02400, 100=0,00970, 1000=0,00437, 2500=0,00379, 5000=0,00313 (USD); RoHS: Yes; Mount: Surface Mount; Case/Package: 0201; Case Code (Metric): 0603; Case Code (Imperial): 0201; Contact Plating: Tin,Matte; Min Operating Temperature: -55°C; Max Operating Temperature: 125°C; Packaging: Tape and Reel; Tolerance: 1%; Package Quantity: 10000; Resistor Type: Thick Film; Number of Terminations: 2; Series: RMCF; Length: 0.024inch; Width: 0.012inch; Height: 0.009inch; Radiation Hardening: No; RoHS Compliant: Yes; ComponentLink8URL: https://www.seielect.com/catalog/SEI-Packaging.pdf?src-supplier=Digi-Key; ComponentLink8Description: https://www.seielect.com/catalog/SEI-Packaging.pdf?src-supplier=Digi-Key; ComponentLink9URL: https://www.seielect.com/Catalog/SEI-RMCF_RMCP.pdf?src-supplier=Digi-Key; ComponentLink9Description: https://www.seielect.com/Catalog/SEI-RMCF_RMCP.pdf?src-supplier=Digi-Key; ComponentLink10URL: https://www.seielect.com/catalog/SEI-RMCF_RMCP.pdf?src-supplier=Avnet; ComponentLink10Description: https://www.seielect.com/catalog/SEI-RMCF_RMCP.pdf?src-supplier=Avnet; ComponentLink11URL: http://www.seielect.com/Catalog/SEI-RMCF_RMCP.pdf?src-supplier=Digi-Key; ComponentLink11Description: http://www.seielect.com/Catalog/SEI-RMCF_RMCP.pdf?src-supplier=Digi-Key
R197 R213 R215 R216 = Res_0402: Part Description: 3.3 kOhms ±1% 0.05W, 1/20W Chip Resistor 0201 (0603 Metric) Moisture Resistant Thick Film; Manufacturer: Yageo; Manufacturer Part Number 1: RC0201FR-073K3L; Resistance: 3.3kR; Power Rating: 50mW; Voltage Rating: 25V; Temperature Coefficient: 200ppm/°C; ComponentLink1URL: http://www.yageo.com/documents/recent/PYu-RC_Group_51_RoHS_L_7.pdf; ComponentLink1Description: http://www.yageo.com/documents/recent/PYu-RC_Group_51_RoHS_L_7.pdf; Value: 3k3, 1%; Supplier 1: Digi-Key; Supplier Part Number 1: YAG2285CT-ND; Stock 1: 586100; Pricing 1: 1=0,10000, 10=0,03700, 100=0,01500, 1000=0,00672, 2500=0,00583, 5000=0,00482 (USD); RoHS: Yes; Case/Package: 0201; Case Code (Metric): 0603; Case Code (Imperial): 0201; Min Operating Temperature: -55°C; Max Operating Temperature: 125°C; Tolerance: 1%; Packaging: Tape and Reel; Package Quantity: 10000; Resistor Type: Thick Film; Number of Terminations: 2; Termination: SMD/SMT; Max Power Dissipation: 50mW; Features: Moisture Resistant; Series: RC; Construction: Rectangular; Resistance Tolerance: 1%; Length: 0.024inch; Width: 0.3mm; Height: 0.01inch; Depth: 0.3mm; Military Standard: Not; RoHS Compliant: Yes; ComponentLink2URL: https://datasheet.ciiva.com/22698/1563626-22698524.pdf?src-supplier=Element14; ComponentLink2Description: https://datasheet.ciiva.com/22698/1563626-22698524.pdf?src-supplier=Element14; ComponentLink3URL: https://datasheet.ciiva.com/14985/pyu-r-int-thick-7-14985418.pdf?src-supplier=Digi-Key; ComponentLink3Description: https://datasheet.ciiva.com/14985/pyu-r-int-thick-7-14985418.pdf?src-supplier=Digi-Key
R198 = Res_0402: Part Description: 47 kOhms ±1% 0.05W, 1/20W Chip Resistor 0201 (0603 Metric) Moisture Resistant Thick Film; Manufacturer: Yageo; Manufacturer Part Number 1: RC0201FR-0747KL; Resistance: 47kR; Power Rating: 50mW; Voltage Rating: 25V; Temperature Coefficient: 200ppm/°C; ComponentLink1URL: http://www.yageo.com/documents/recent/PYu-RC_Group_51_RoHS_L_7.pdf; ComponentLink1Description: http://www.yageo.com/documents/recent/PYu-RC_Group_51_RoHS_L_7.pdf; Value: 47k, 1%; Supplier 1: Digi-Key; Supplier Part Number 1: 311-47KMCT-ND; Stock 1: 684352; Pricing 1: 1=0,10000, 10=0,03700, 100=0,01500, 1000=0,00672, 2500=0,00583, 5000=0,00482 (USD); RoHS: Yes; Case/Package: 0201; Case Code (Metric): 0603; Case Code (Imperial): 0201; Weight: 6E-06oz; Contact Plating: Tin,Matte; Size Code: 0201; Min Operating Temperature: -55°C; Max Operating Temperature: 125°C; Tolerance: 1%; Packaging: Tape and Reel; Package Quantity: 10000; Resistor Type: Thick Film; Number of Terminations: 2; Termination: SMD/SMT; Max Power Dissipation: 50mW; Features: Moisture Resistant; Series: RC; Resistance Tolerance: 1%; Construction: Rectangular; Length: 0.6mm; Width: 0.3mm; Height: 0.01inch; Depth: 0.3mm; Radiation Hardening: No; Military Standard: Not; Lead Free: Lead Free; RoHS Compliant: Yes; ComponentLink2URL: https://datasheet.ciiva.com/7672/1563626-7672232.pdf?src-supplier=Element14; ComponentLink2Description: https://datasheet.ciiva.com/7672/1563626-7672232.pdf?src-supplier=Element14; ComponentLink3URL: https://datasheet.ciiva.com/29710/pyu-r-int-thick-7-29710919.pdf?src-supplier=Digi-Key; ComponentLink3Description: https://datasheet.ciiva.com/29710/pyu-r-int-thick-7-29710919.pdf?src-supplier=Digi-Key; ComponentLink4URL: https://datasheet.ciiva.com/29710/pyu-r-int-thick-7-29710920.pdf?src-supplier=Digi-Key; ComponentLink4Description: https://datasheet.ciiva.com/29710/pyu-r-int-thick-7-29710920.pdf?src-supplier=Digi-Key; ComponentLink5URL: https://datasheet.ciiva.com/25647/pyu-r-int-thick-7-25647310.pdf?src-supplier=Digi-Key; ComponentLink5Description: https://datasheet.ciiva.com/25647/pyu-r-int-thick-7-25647310.pdf?src-supplier=Digi-Key; ComponentLink6URL: https://datasheet.ciiva.com/26829/getdatasheetpartid-422496-26829867.pdf?src-supplier=Verical; ComponentLink6Description: https://datasheet.ciiva.com/26829/getdatasheetpartid-422496-26829867.pdf?src-supplier=Verical; ComponentLink7URL: https://datasheet.ciiva.com/8889/pyu-rc0201-51-rohs-l-8-8889065.pdf?src-supplier=Avnet; ComponentLink7Description: https://datasheet.ciiva.com/8889/pyu-rc0201-51-rohs-l-8-8889065.pdf?src-supplier=Avnet
R199 R214 = Res_0402: Manufacturer: Yageo; Manufacturer Part Number 1: RC0201FR-07100KL; Part Description: 100 kOhms ±1% 0.05W, 1/20W Chip Resistor 0201 (0603 Metric) Moisture Resistant Thick Film; Max Power Dissipation: 50mW; Resistance: 100kR; Temperature Coefficient: 200ppm/°C; Voltage Rating (DC): 25V; ComponentLink1URL: https://datasheet.ciiva.com/7672/1563626-7672204.pdf?src-supplier=Element14; ComponentLink1Description: https://datasheet.ciiva.com/7672/1563626-7672204.pdf?src-supplier=Element14; ComponentLink2URL: https://datasheet.ciiva.com/22698/1563626-22698505.pdf?src-supplier=Element14; ComponentLink2Description: https://datasheet.ciiva.com/22698/1563626-22698505.pdf?src-supplier=Element14; ComponentLink3URL: https://datasheet.ciiva.com/29721/pyu-r-int-thick-7-29721196.pdf?src-supplier=Digi-Key; ComponentLink3Description: https://datasheet.ciiva.com/29721/pyu-r-int-thick-7-29721196.pdf?src-supplier=Digi-Key; Case/Package: 0201; Case Code (Imperial): 0201; Case Code (Metric): 0603; ComponentLink4Description: https://datasheet.ciiva.com/29721/pyu-r-int-thick-7-29721195.pdf?src-supplier=Digi-Key; ComponentLink4URL: https://datasheet.ciiva.com/29721/pyu-r-int-thick-7-29721195.pdf?src-supplier=Digi-Key; ComponentLink5Description: https://datasheet.ciiva.com/8896/pyu-rc0201-51-rohs-l-8-8896174.pdf?src-supplier=Avnet; ComponentLink5URL: https://datasheet.ciiva.com/8896/pyu-rc0201-51-rohs-l-8-8896174.pdf?src-supplier=Avnet; ComponentLink6Description: https://datasheet.ciiva.com/7660/1421516-7660806.pdf?src-supplier=Element14; ComponentLink6URL: https://datasheet.ciiva.com/7660/1421516-7660806.pdf?src-supplier=Element14; ComponentLink7Description: https://datasheet.ciiva.com/22698/1563626-22698495.pdf?src-supplier=Element14; ComponentLink7URL: https://datasheet.ciiva.com/22698/1563626-22698495.pdf?src-supplier=Element14; ComponentLink8Description: https://datasheet.ciiva.com/46391/1421516-46391338.pdf?src-supplier=Element14; ComponentLink8URL: https://datasheet.ciiva.com/46391/1421516-46391338.pdf?src-supplier=Element14; ComponentLink9Description: https://datasheet.ciiva.com/2493/pyu-r-int-thick-7-2493770.pdf?src-supplier=Digi-Key; ComponentLink9URL: https://datasheet.ciiva.com/2493/pyu-r-int-thick-7-2493770.pdf?src-supplier=Digi-Key; ComponentLink10Description: https://datasheet.ciiva.com/2493/pyu-r-int-thick-7-2493771.pdf?src-supplier=Digi-Key; ComponentLink10URL: https://datasheet.ciiva.com/2493/pyu-r-int-thick-7-2493771.pdf?src-supplier=Digi-Key; ComponentLink11Description: https://datasheet.ciiva.com/2493/pyu-r-int-thick-7-2493769.pdf?src-supplier=Digi-Key; ComponentLink11URL: https://datasheet.ciiva.com/2493/pyu-r-int-thick-7-2493769.pdf?src-supplier=Digi-Key; ComponentLink12Description: https://datasheet.ciiva.com/26829/getdatasheetpartid-420441-26829850.pdf?src-supplier=Verical; ComponentLink12URL: https://datasheet.ciiva.com/26829/getdatasheetpartid-420441-26829850.pdf?src-supplier=Verical; Construction: Rectangular; Contact Plating: Tin,Matte; Depth: 0.3mm; Features: Moisture Resistant; Height: 0.01inch; Lead Free: Lead Free; Length: 0.024inch; Max Operating Temperature: 125°C; Military Standard: Not; Min Operating Temperature: -55°C; Number of Pins: 2; Number of Terminations: 2; Package Quantity: 10000; Packaging: Tape and Reel; Power Rating: 50mW; Pricing 1: 1=0,10000, 10=0,03700, 100=0,01500, 1000=0,00672, 2500=0,00583, 5000=0,00482 (USD); Reach SVHC Compliant: Yes; Resistance Tolerance: 1%; Resistor Type: Thick Film; RoHS: Yes; RoHS Compliant: Yes; Series: RC; Size Code: 0201; Stock 1: 6001055; Supplier 1: Digi-Key; Supplier Part Number 1: 311-100KMCT-ND; Termination: SMD/SMT; Tolerance: 1%; Value: 100k, 1%; Voltage Rating: 25V; Width: 0.012inch
R201 R202 R204 R205 = Res_0402: Manufacturer Part Number 1: RC0402JR-070RL; Manufacturer: Yageo; Part Description: RES SMD 0.0OHM JUMPER 1/16W 0402; Resistance (Ohms): 0.0; Tolerance: Jumper; Power (Watts): 0.063W, 1/16W; Value: 0R; Supplier 1: Digi-Key; Supplier Part Number 1: 311-0.0JRTR-ND; Category: Resistors; Temperature Coefficient: -; Features: Moisture Resistant; Supplier Device Package: 0402; Height: 0.016" (0.40mm); Package / Case: 0402 (1005 Metric); Operating Temperature: -55°C ~ 155°C; Size / Dimension: 0.039" L x 0.020" W (1.00mm x 0.50mm); Composition: Thick Film; Packaging: Tape & Reel (TR); Number of Terminations: 2; RoHS: RoHS Compliant
R207 = Res_0402: Manufacturer: Yageo; Manufacturer Part Number 1: RC0201FR-0712K7L; Part Description: 12.7 kOhms ±1% 0.05W, 1/20W Chip Resistor 0201 (0603 Metric) Moisture Resistant Thick Film; Resistance: 12.7kR; Temperature Coefficient: 200ppm/°C; Max Power Dissipation: 50mW; Value: 12.7k, 1%; ComponentLink1URL: https://datasheet.ciiva.com/5924/1563626-5924912.pdf?src-supplier=Farnell; ComponentLink1Description: https://datasheet.ciiva.com/5924/1563626-5924912.pdf?src-supplier=Farnell; ComponentLink2URL: https://datasheet.ciiva.com/22661/1563626-22661319.pdf?src-supplier=Element14; ComponentLink2Description: https://datasheet.ciiva.com/22661/1563626-22661319.pdf?src-supplier=Element14; ComponentLink3URL: https://datasheet.ciiva.com/7660/1421516-7660807.pdf?src-supplier=Element14; ComponentLink3Description: https://datasheet.ciiva.com/7660/1421516-7660807.pdf?src-supplier=Element14; ComponentLink4URL: https://datasheet.ciiva.com/46391/1421516-46391339.pdf?src-supplier=Element14; ComponentLink4Description: https://datasheet.ciiva.com/46391/1421516-46391339.pdf?src-supplier=Element14; ComponentLink5URL: https://datasheet.ciiva.com/2467/pyu-r-int-thick-7-2467110.pdf?src-supplier=Digi-Key; ComponentLink5Description: https://datasheet.ciiva.com/2467/pyu-r-int-thick-7-2467110.pdf?src-supplier=Digi-Key; ComponentLink6URL: https://datasheet.ciiva.com/2467/pyu-r-int-thick-7-2467111.pdf?src-supplier=Digi-Key; ComponentLink6Description: https://datasheet.ciiva.com/2467/pyu-r-int-thick-7-2467111.pdf?src-supplier=Digi-Key; ComponentLink7URL: https://datasheet.ciiva.com/2467/pyu-r-int-thick-7-2467109.pdf?src-supplier=Digi-Key; ComponentLink7Description: https://datasheet.ciiva.com/2467/pyu-r-int-thick-7-2467109.pdf?src-supplier=Digi-Key; Supplier 1: Digi-Key; Supplier Part Number 1: 311-12.7KMCT-ND; Stock 1: 49027; Pricing 1: 1=0,10000, 10=0,03700, 100=0,01500, 1000=0,00672, 2500=0,00583, 5000=0,00482 (USD); RoHS: Yes; Case/Package: 0201; Case Code (Metric): 0603; Case Code (Imperial): 0201; Min Operating Temperature: -55°C; Max Operating Temperature: 125°C; Package Quantity: 1; Tolerance: 1%; Packaging: Tape and Reel; Resistor Type: Thick Film; Number of Terminations: 2; Features: Moisture Resistant; Series: RC; Length: 0.024inch; Width: 0.012inch; Height: 0.01inch; RoHS Compliant: Yes; ComponentLink8URL: https://datasheet.ciiva.com/2493/pyu-r-int-thick-7-2493806.pdf?src-supplier=Digi-Key; ComponentLink8Description: https://datasheet.ciiva.com/2493/pyu-r-int-thick-7-2493806.pdf?src-supplier=Digi-Key; ComponentLink9URL: https://datasheet.ciiva.com/2493/pyu-r-int-thick-7-2493807.pdf?src-supplier=Digi-Key; ComponentLink9Description: https://datasheet.ciiva.com/2493/pyu-r-int-thick-7-2493807.pdf?src-supplier=Digi-Key; ComponentLink10URL: https://datasheet.ciiva.com/2493/pyu-r-int-thick-7-2493805.pdf?src-supplier=Digi-Key; ComponentLink10Description: https://datasheet.ciiva.com/2493/pyu-r-int-thick-7-2493805.pdf?src-supplier=Digi-Key